# EAGLE design BotMod (EAGLE 9.5.1)
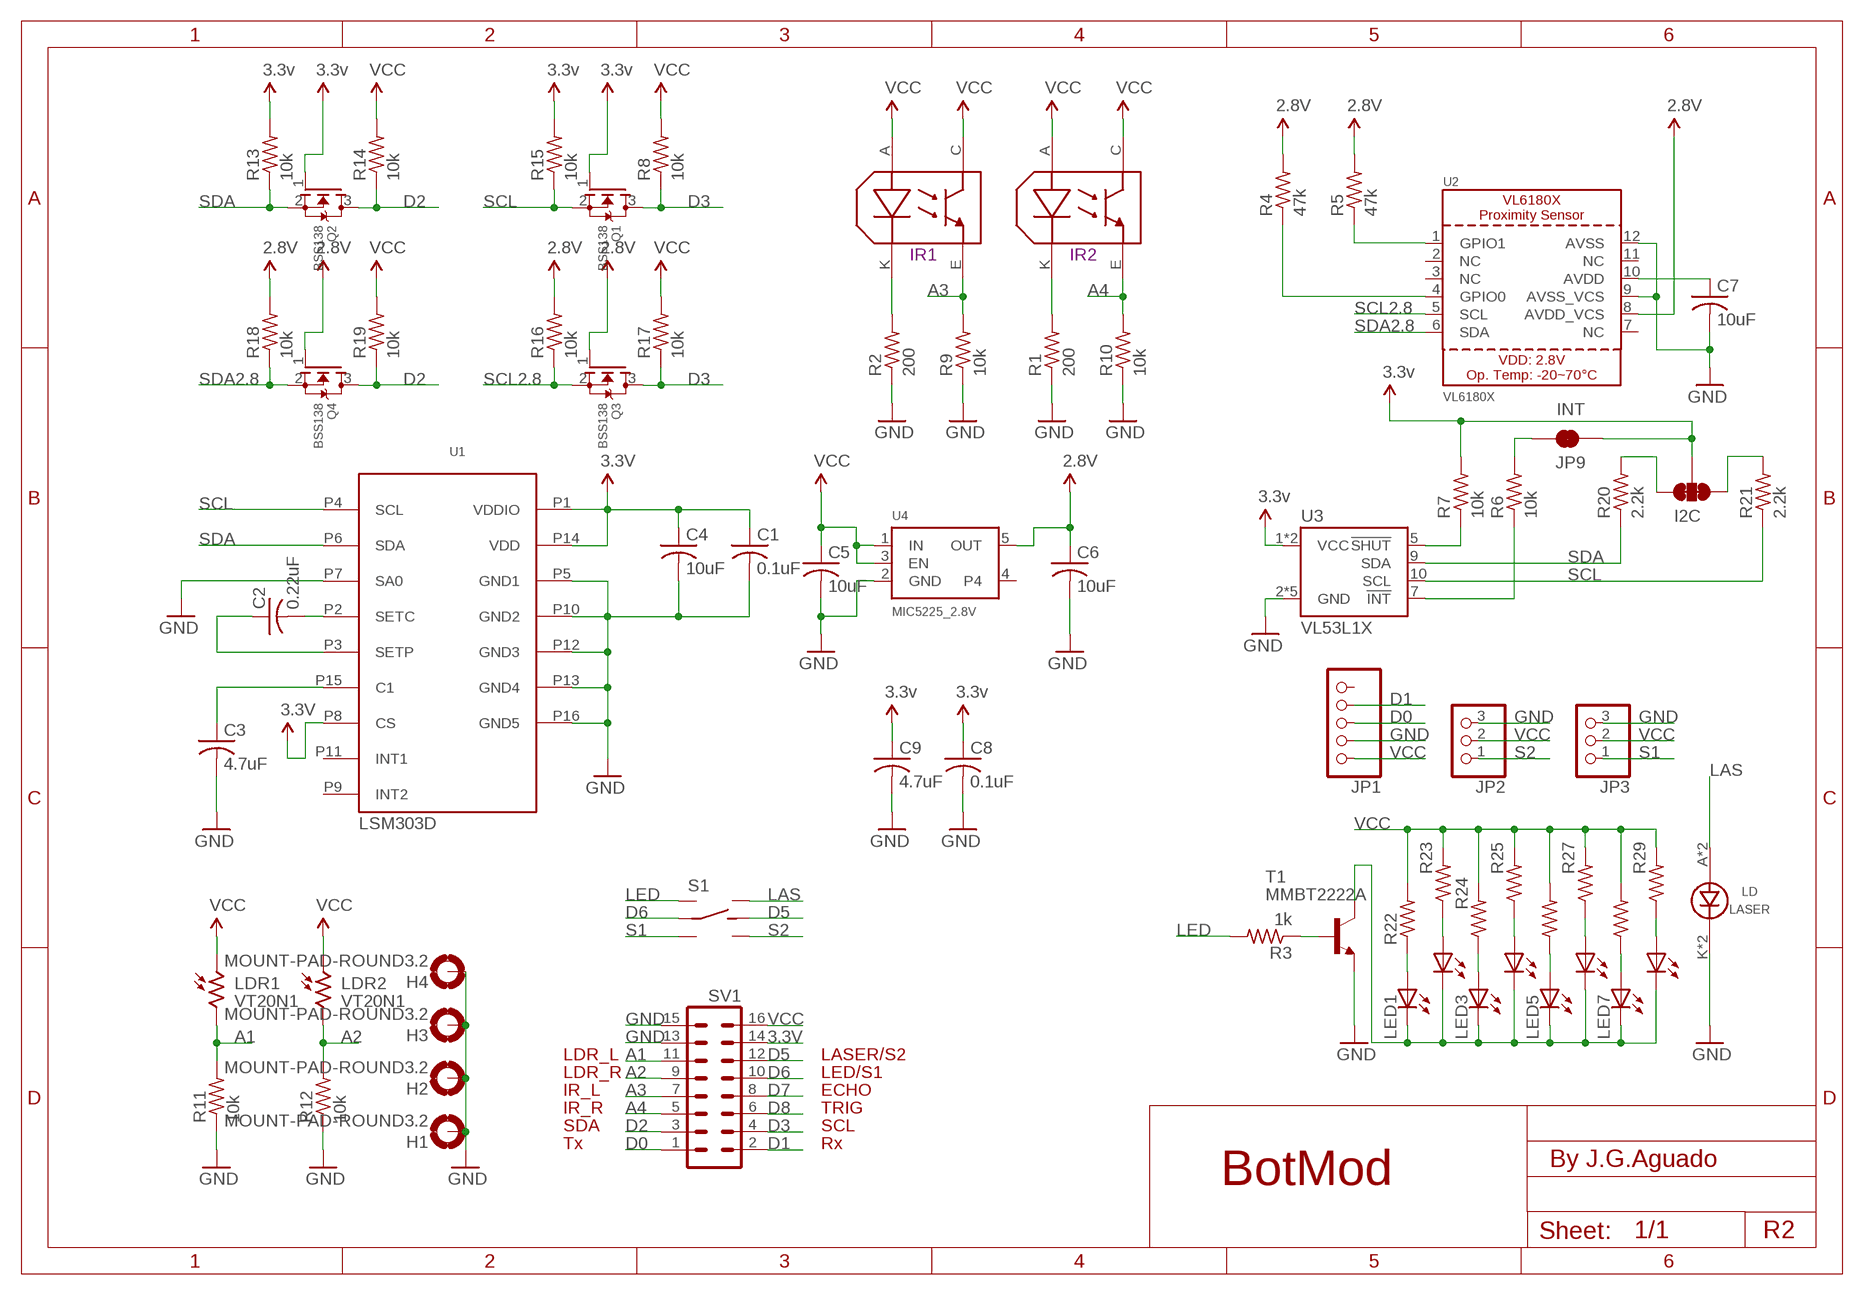
[diagram p0: schematic, sheet 1]

## Parts
C1  0.1uF  C0402  [0402]
C2  0.22uF  C0402  [0402]
C3  4.7uF  C0402  [0402]
C4  10uF  C0402  [0402]
C5  10uF  C0402  [0402]
C6  10uF  C0402  [0402]
C7  10uF  C0402  [0402]
C8  0.1uF  C0402  [0402]
C9  4.7uF  C0402  [0402]
H1  MOUNT-PAD-ROUND3.2  [3,2-PAD]
H2  MOUNT-PAD-ROUND3.2  [3,2-PAD]
H3  MOUNT-PAD-ROUND3.2  [3,2-PAD]
H4  MOUNT-PAD-ROUND3.2  [3,2-PAD]
I2C  JUMPER-SMT_3_2-NC_TRACE_SILK  [SMT-JUMPER_3_2-NC_TRACE_SILK]
IR1  IR_TCRT5000  [IR_TCRT5000]
IR2  IR_TCRT5000  [IR_TCRT5000]
JP1  PINHEAD_5_FEMALE  [PINHEAD_5_FEMALE]
JP2  PINHD-1X3  [1X03]
JP3  PINHD-1X3  [1X03]
JP9  INT  JUMPER-PAD-2-NC_BY_TRACE  [PAD-JUMPER-2-NC_BY_TRACE_YES_SILK]
LD  LASER  KEYES_LASER  [KEYES_LASER]
LDR1  VT20N1  [TO46-VT200]
LDR2  VT20N1  [TO46-VT200]
LED1  LED5730  [LED5730]
LED2  LED5730  [LED5730]
LED3  LED5730  [LED5730]
LED4  LED5730  [LED5730]
LED5  LED5730  [LED5730]
LED6  LED5730  [LED5730]
LED7  LED5730  [LED5730]
LED8  LED5730  [LED5730]
Q1  BSS138  MOSFET-NREFLOW  [SOT23]
Q2  BSS138  MOSFET-NREFLOW  [SOT23]
Q3  BSS138  MOSFET-NREFLOW  [SOT23]
Q4  BSS138  MOSFET-NREFLOW  [SOT23]
R1  200  R0402  [0402]
R2  200  R0402  [0402]
R3  1k  R0402  [0402]
R4  47k  R0402  [0402]
R5  47k  R0402  [0402]
R6  10k  R0402  [0402]
R7  10k  R0402  [0402]
R8  10k  R0402  [0402]
R9  10k  R0402  [0402]
R10  10k  R0402  [0402]
R11  10k  R0402  [0402]
R12  10k  R0402  [0402]
R13  10k  R0402  [0402]
R14  10k  R0402  [0402]
R15  10k  R0402  [0402]
R16  10k  R0402  [0402]
R17  10k  R0402  [0402]
R18  10k  R0402  [0402]
R19  10k  R0402  [0402]
R20  2.2k  R0402  [0402]
R21  2.2k  R0402  [0402]
R22  R1206  [1206]
R23  R1206  [1206]
R24  R1206  [1206]
R25  R1206  [1206]
R26  R1206  [1206]
R27  R1206  [1206]
R28  R1206  [1206]
R29  R1206  [1206]
S1  DPDT_JS202011CQN  [DPDT_JS202011CQN]
SV1  MA08-2  [MA08-2]
T1  MMBT2222A  BC808-NPN-SOT23-BEC  [SOT23-BEC]
U1  LSM303D  [LGA3X3_16L]
U2  VL6180X  [VL6180]
U3  VL53L1X  VL53L1XSMD  [VL53L1X]
U4  MIC5225_2.8V  VREG_SOT23-5  [SOT23-5]

## Nets
2.8V: C6.1 Q3.1(G) Q4.1(G) R4.2 R5.2 R16.2 R18.2 U2.8(AVDD_VCS) U4.5(OUT)
3.3V: C1.1 C4.1 C8.1 C9.1 I2C.2 JP9.1 Q1.1(G) Q2.1(G) R7.2 R13.2 R15.2 SV1.14 U1.P1(VDDIO) U1.P8(CS) U1.P14(VDD) U3.1(VCC) U3.11(VCC) ; supply symbol labelled 3.3v
A1: LDR1.2 R11.2 SV1.11
A2: LDR2.2 R12.2 SV1.9
A3: IR1.E R9.2 SV1.7
A4: IR2.E R10.2 SV1.5
D0: JP1.P$3 SV1.1
D1: JP1.P$4 SV1.2
D2: Q2.3(D) Q4.3(D) R14.1 R19.1 SV1.3
D3: Q1.3(D) Q3.3(D) R8.1 R17.1 SV1.4
D5: S1.5(RC) SV1.12
D6: S1.2(LC) SV1.10
D7: SV1.8
D8: SV1.6
GND: C1.2 C3.2 C4.2 C5.2 C6.2 C7.2 C8.2 C9.2 H1.B3,2(MOUNT) H2.B3,2(MOUNT) H3.B3,2(MOUNT) H4.B3,2(MOUNT) JP1.P$2 JP2.3 JP3.3 LD.K LD.K1(K) R1.1 R2.1 R9.1 R10.1 R11.1 R12.1 SV1.13 SV1.15 T1.E U1.P5(GND1) U1.P7(SA0) U1.P10(GND2) U1.P12(GND3) U1.P13(GND4) U1.P16(GND5) U2.9(AVSS_VCS) U2.12(AVSS) U3.2(GND) U3.3(GND) U3.4(GND) U3.6(GND) U3.12(GND) U4.2(GND)
L1: LED1.P$1(A) R22.1
L2: LED2.P$1(A) R23.1
L3: LED3.P$1(A) R24.1
L4: LED4.P$1(A) R25.1
L5: LED5.P$1(A) R26.1
L6: LED8.P$1(A) R29.1
L7: LED7.P$1(A) R28.1
L8: LED6.P$1(A) R27.1
LAS: LD.A LD.A1(A) S1.4(R1)
LED: R3.2 S1.1(L1)
N$1: LED1.P$2(C) LED2.P$2(C) LED3.P$2(C) LED4.P$2(C) LED5.P$2(C) LED6.P$2(C) LED7.P$2(C) LED8.P$2(C) T1.C
N$2: R3.1 T1.B
N$3: IR1.K R2.2
N$4: IR2.K R1.2
N$5: R5.1 U2.1(GPIO1)
N$6: R4.1 U2.4(GPIO0)
N$7: I2C.3 R20.2
N$8: C7.1 U2.10(AVDD)
N$9: I2C.1 R21.2
N$10: C3.1 U1.P15(C1)
N$11: C2.2 U1.P2(SETC)
N$12: C2.1 U1.P3(SETP)
N$14: JP9.2 R6.2
N$16: R7.1 U3.5(!SHUT)
N$19: R6.1 U3.7(!INT)
S1: JP3.1 S1.3(L2)
S2: JP2.1 S1.6(R2)
SCL: Q1.2(S) R15.1 R21.1 U1.P4(SCL) U3.10(SCL)
SCL2.8: Q3.2(S) R16.1 U2.5(SCL)
SDA: Q2.2(S) R13.1 R20.1 U1.P6(SDA) U3.9(SDA)
SDA2.8: Q4.2(S) R18.1 U2.6(SDA)
VCC: C5.1 IR1.A IR1.C IR2.A IR2.C JP1.P$1 JP2.2 JP3.2 LDR1.1 LDR2.1 R8.2 R14.2 R17.2 R19.2 R22.2 R23.2 R24.2 R25.2 R26.2 R27.2 R28.2 R29.2 SV1.16 U4.1(IN) U4.3(EN)
Unconnected: JP1.P$5 U1.P9(INT2) U1.P11(INT1) U2.2(NC) U2.3(NC) U2.7(NC) U2.11(NC) U4.4

## Notes on the sheet
- IR1 | IR2
- LSM303D
- LDR_L | LASER/S2
- LDR_R | LED/S1
- IR_L | ECHO
- IR_R | TRIG
- SDA | SCL
- Tx | Rx
- By J.G.Aguado
- R2

## Library data of the parts
C1-C9 = Passive_components:C0402
H1-H4 = holes:MOUNT-PAD-ROUND: MOUNTING PAD, round
I2C = SparkFun-Jumpers:JUMPER-SMT_3_2-NC_TRACE: Normally closed trace jumper (2 of 2 connections) This jumper has a trace between all three pads so they are normally closed (NC). Use a razor knife to open the connection(s). For best results follow the IPC guidelines for cutting traces: Cutout at least 0.063 mm (0.005 in). Remove all loose material to clean up the cut area. Seal the cut with an approved epoxy. Reapply solder to reclose the connection(s).
IR1 IR2 = SpaceDIY:IR_TCRT5000
JP1 = SpaceDIY_connectors:PINHEAD_5_FEMALE
JP2 JP3 = pinhead:PINHD-1X3: PIN HEADER
JP9 = SparkFun-Passives:JUMPER-PAD-2-NC_BY_TRACE
LD = SpaceDIY:KEYES_LASER
LDR1 LDR2 = photo-elements:VT2*: Photoconductive Cell VT200 Series Source: http://optoelectronics.perkinelmer.com/content/Datasheets/DTS_vt200seriesdatasheet.pdf
LED1-LED8 = SpaceDIY_passive_components:LED5730
Q1-Q4 = adafruit:MOSFET-N: N-Channel Mosfet 2N7002E - 60V 260mA SOT23 [Digikey: 2N7002ET1GOSTR-ND] - REEL BSH103 - 30V 850mA SOT23 [Digikey: 568-5013-1-ND]
R1-R21 = Passive_components:R0402
R22-R29 = Passive_components:R1206
S1 = bt_electromech:DPDT: Dual Position, Dual Throw (DPDT) Switch
SV1 = con-lstb:MA08-2: PIN HEADER; OC_FARNELL: unknown; OC_NEWARK: unknown
T1 = transistor:*-NPN-: NPN Transistror BF959 corrected 2008.03.06
U1 = LSM303D:LSM303D
U2 = microbuilder:VL6180X: VL6180x Proximity and Light Sensor with Gesture Recognition Supply Level: 2.8V (3.0V Max!) Range: 0-10cm Light Sensor: 0..100K Lux (16-bit output) IR emitter: 850 nm I2C Address: 0x29 (7-bit)
U3 = SparkFun-Sensors:VL53L1X: STMicroelectronics VL53L1X - 400 cm IR Laser ToF Sensor VL53L1X is a state-of-the-art ToF laser-ranging sensor, enhancing the ST FlightSense product family. It is the fastest miniature ToF sensor currently on the market with accurate ranging up to 4 m and fast ranging frequency (up to 50 Hz). Housed in a miniature and reflowable package, it integrates a single photon avalanche diode (SPAD) receiving array, a 940 nm invisible laser Class 1 emitter, physical infrared filters, and optics to achieve the best ranging performance in various ambient lighting conditions with a range of cover window options.; PROD_ID: IC-13960
U4 = microbuilder:VREG_SOT23-5: SOT23-5 Fixed Voltage Regulators Part Current Out V Out V In V Dropout θJA (°C/W) TJ (°C) Digikey Part No. ADP121 150mA 3.3V 3.4-5.5V 0.09V @ 150mA -- -- ADP121-AUJZ33R7CT-ND ADP121 150mA 3.0V 3.1-5.5V 0.09V @ 150mA -- -- ADP121-AUJZ30R7CT-ND ADP122 300mA 3.3V 3.4-5.5V 0.085V @ 300mA -- -- ADP122AUJZ-3.3-R7CT-ND ADP1712 300mA 3.3V 3.5-5.5V 0.17V @ 300mA -- -- ADP1712AUJZ-3.3-R7TR-ND AP7311 (Low Cost) 150mA 3.3V 3.5-6V 0.15V @ 150mA -- -- AP7311-33WG-7DICT-ND LD39015M18R 150mA 1.8V 1.9V-5.5V 0.08V @ 100mA -- -- 497-6977-1-ND LP2985A-33DBVR 150mA 3.3V 3.3-16V 0.28V @ 150mA 206 150 296-18479-1-ND MCP1824T-3302E/OT 300mA 3.3V 3.5V-6V 0.2V @ 300mA -- -- MCP1824T-3302E/OTCT-ND MIC5205-2.5YM5 TR 150mA 2.5V 2.7-16V 0.165V @ 150mA -- -- 576-1257-2-ND MIC5205-3.0YM5 TR 150mA 3.0V 3.2V-16V 0.165V @ 150mA -- -- 576-1258-2-ND MIC5205-3.3YM5 TR 150mA 3.3V 3.5V-16V 0.165V @ 150mA -- -- 576-1259-2-ND TPS780330220 150mA 3.3V+2.2V 3.6-5.5V 250mV Max -- -- 296-23332-1-ND TDA3663/N1,135 100mA 3.3V 3.5-45V 0.18V @ 50mA -- -- 568-5343-1-ND Max operating temp can be calculated using θJA, TJ (max junction temperature), and power in watts. Set the "Maximum Ambient Temperature" until it reaches TJ ("Max Junction Temperature"), which is the absolute limit for safe use of the regulator: Heat Sink Temperature Calculator <http://www.daycounter.com/Calculators/Heat-Sink-Temperature-Calculator.phtml> For example, With 12V source into a 3.3V LP2985 and a 30mA load, we are dissipating (12V-3.3V) * 0.03A = 0.261W. With a θJA of 206 °C/W, a TJ of 150°C, and 261mW we can safely use the chip without a heat sink up to 75°C (=147.1°C Junction Temperature).

## Net classes
1 vcc: width 0.254 mm

## Board
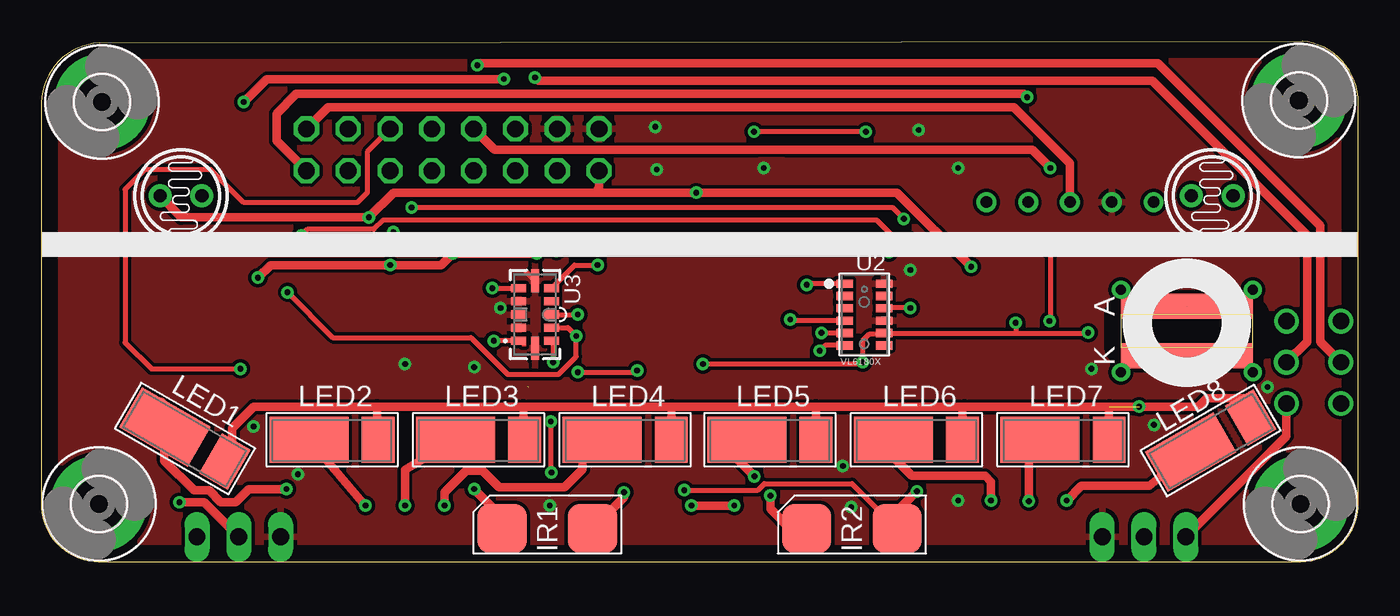
[diagram p1: board, top side]
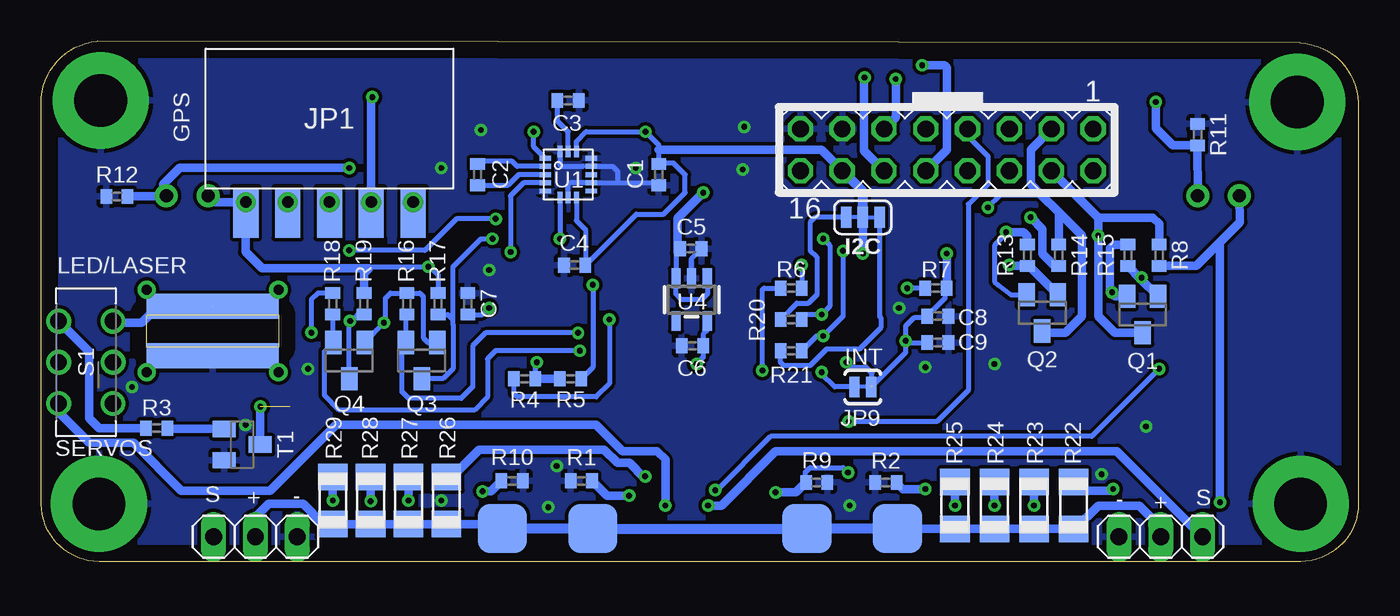
[diagram p2: board, bottom side, seen from below]

Size 80.02 x 31.6 mm. Coordinates in mm from the lower left corner, seen from the top.
Outline: 0,27.53 0,3.5 arc90 3.5,0 76.5,0 arc90 80,3.5 80,27.5 arc90 76.61,31.6 3.55,31.5 arc90 0,27.53
Copper layers (1*16): Top 0.035mm / dielectric 1.5mm / Bottom 0.035mm
Design rules "PCBWay": minimum track width 6mil, minimum drill 0.3mm, track to track 0.205mm, track to pad 0.205mm, pad to pad 0.205mm, via to via 0.205mm, smd to smd 8mil, copper to edge 40mil, drill to drill 8mil, minimum pad ring 10mil, minimum via ring 8mil, stop-mask expansion 4mil, vias tented up to drill 25mil, thermal gap 10mil

### Footprints (pad centres in the part's own frame; a part is rotated, then mirrored left to right if it is on the bottom)
0402 = smd 0.7 x 0.9: 1 -0.65,0; 2 0.65,0
3,2-PAD = drill 3.2 pad 5.842: B3,2 0,0
SMT-JUMPER_3_2-NC_TRACE_SILK = smd 0.635 x 1.27: 1 -1.016,0; 2 0,0; 3 1.016,0
IR_TCRT5000 = smd 3 x 3 bottom: A -2.75,0; C 2.75,0 | smd 3 x 3: E 2.75,0; K -2.75,0
PINHEAD_5_FEMALE = drill 0.7: P$1 -5.08,-5.08; P$2 -2.54,-5.08; P$3 0,-5.08; P$4 2.54,-5.08; P$5 5.08,-5.08 | smd 1.524 x 3.048: P$6 -5.08,-5.715; P$7 -2.54,-5.715; P$8 0,-5.715; P$9 2.54,-5.715; P$10 5.08,-5.715
1X03 = drill 1.016 long: 1 -2.54,0; 2 0,0; 3 2.54,0
PAD-JUMPER-2-NC_BY_TRACE_YES_SILK = smd 0.635 x 1.27: 1 -0.508,0; 2 0.508,0
KEYES_LASER = smd 1.5 x 8 bottom: A 1.5,0; K -1.5,0 | smd 1.5 x 8: A1 1.5,0; K1 -1.5,0 | drill 0.6: P$1 -2.5,4; P$2 -2.5,-4; P$3 2.5,-4; P$4 2.5,4
TO46-VT200 = drill 0.8 pad 1.4: 1 -1.27,0; 2 1.27,0
LED5730 = smd 4.8 x 2.8: P$1 -1.525,-0.11 | smd 2 x 2.8: P$2 2.675,-0.11
SOT23 = smd 1 x 1.4: 1 -0.95,-1.1; 2 0.95,-1.1; 3 0,1.1
1206 = smd 1.6 x 1.803: 1 -1.422,0; 2 1.422,0
DPDT_JS202011CQN = drill 1: 1 -2.5,-1.65; 2 0,-1.651; 3 2.5,-1.65; 4 -2.5,1.65; 5 0,1.651; 6 2.5,1.65
MA08-2 = drill 1.016 octagon: 1 -8.89,-1.27; 2 -8.89,1.27; 3 -6.35,-1.27; 4 -6.35,1.27; 5 -3.81,-1.27; 6 -3.81,1.27; 7 -1.27,-1.27; 8 -1.27,1.27; 9 1.27,-1.27; 10 1.27,1.27; 11 3.81,-1.27; 12 3.81,1.27; 13 6.35,-1.27; 14 6.35,1.27; 15 8.89,-1.27; 16 8.89,1.27
SOT23-BEC = smd 1 x 1.4: B -0.95,-1.1; C 0,1.1; E 0.95,-1.1
LGA3X3_16L = smd 0.7 x 0.3: P1 -1.4,1; P2 -1.4,0.5; P3 -1.4,0; P4 -1.4,-0.5; P5 -1.4,-1; P9 1.4,-1; P10 1.4,-0.5; P11 1.4,0; P12 1.4,0.5; P13 1.4,1 | smd 0.3 x 0.7: P6 -0.5,-1.4; P7 0,-1.4; P8 0.5,-1.4; P14 0.5,1.4; P15 0,1.4; P16 -0.5,1.4
VL6180 = smd 1 x 0.5: 1 -1.2,1.875; 2 -1.2,1.125; 3 -1.2,0.375; 4 -1.2,-0.375; 5 -1.2,-1.125; 6 -1.2,-1.875; 7 1.2,-1.875; 8 1.2,-1.125; 9 1.2,-0.375; 10 1.2,0.375; 11 1.2,1.125; 12 1.2,1.875
VL53L1X = smd 0.5 x 0.9: 1 1.6,-1; 2 0.8,-1; 3 0,-1; 4 -0.8,-1; 5 -1.6,-1; 7 -1.6,1; 8 -0.8,1; 9 0,1; 10 0.8,1; 11 1.6,1 | smd 1.4 x 0.5: 6 -2.05,0; 12 2.05,0
SOT23-5 = smd 0.55 x 1.2: 1 -0.95,-1.3; 2 0,-1.3; 3 0.95,-1.3; 4 0.95,1.3; 5 -0.95,1.3

### Placement (x,y rotation side)
C1  42.5,23.5 270 bottom
C2  53.5,23.5 90 bottom
C3  48,28 0 bottom
C4  47.6,18 180 bottom
C5  40.55,19 0 bottom
C6  40.45,13.1 180 bottom
C7  54.1,15.65 90 bottom
C8  25.55,14.9 0 bottom
C9  25.55,13.3 0 bottom
H1  3.7,27.9 0 top
H2  76.4,28 0 top
H3  76.5,3.5 0 top
H4  3.5,3.5 0 top
I2C  30.1,20.9 180 bottom
IR1  30.75,2 0 top
IR2  49.25,2 0 top
JP1  62.5,26.9 0 bottom
JP2  67,1.5 0 bottom
JP3  12,1.5 180 bottom
JP9  30.1,10.6 180 bottom
LD  69.6,14 90 top
LDR1  8.49,22.21 0 top
LDR2  71.14,22.21 0 top
LED1  8.9,7.5 330 top
LED2  17.8,7.5 0 top
LED3  26.7,7.5 0 top
LED4  35.6,7.5 0 top
LED5  44.4,7.5 0 top
LED6  53.3,7.5 0 top
LED7  62.2,7.5 0 top
LED8  71.1,7.5 30 top
Q1  13.1,15 180 bottom
Q2  19.2,15.1 180 bottom
Q3  56.9,12.2 180 bottom
Q4  61.3,12.2 180 bottom
R1  47.2,4.9 0 bottom
R2  28.7,4.8 0 bottom
R3  73,8.1 180 bottom
R4  50.65,11.1 0 bottom
R5  47.85,11.1 180 bottom
R6  34.45,16.6 180 bottom
R7  25.65,16.6 0 bottom
R8  12.1,18.6 270 bottom
R9  32.9,4.8 180 bottom
R10  51.4,4.9 180 bottom
R11  9.76,25.92 270 bottom
R12  75.41,22.17 0 bottom
R13  20.1,18.6 270 bottom
R14  18.2,18.6 270 bottom
R15  14,18.6 270 bottom
R16  57.8,15.65 90 bottom
R17  55.9,15.65 90 bottom
R18  62.3,15.65 90 bottom
R19  60.4,15.65 90 bottom
R20  34.45,14.7 180 bottom
R21  34.45,12.8 180 bottom
R22  17.3,3.4 270 bottom
R23  19.7,3.4 270 bottom
R24  22.1,3.4 270 bottom
R25  24.5,3.4 270 bottom
R26  55.4,3.7 270 bottom
R27  57.7,3.7 270 bottom
R28  60,3.7 270 bottom
R29  62.3,3.7 270 bottom
S1  77.3,12.1 270 bottom
SV1  25,25 180 bottom
T1  67.8,7.1 270 bottom
U1  48,23.5 0 bottom
U2  50,15 0 top
U3  30,15 270 top
U4  40.5,15.9 180 bottom

### Tracks (layer width: path | path; a pad name or v marks a point on that pad's centre or on a via)
2.8V  (via drill 0.35)
  Top 0.305: v40.2,12 49.8,12 v49.9,12.1 49.9,13.4 50.3,13.8 51.13,13.8 U2.8 59.2,13.88 | v63.6,13.9 63.58,13.88 59.2,13.88 | v59.2,14.5 59.2,13.88
  Bottom 0.305: U4.5 39.55,14.05 39.8,13.8 C6.1 39.8,12.4 v40.2,12 | v49.9,12.1 50,12 R4.2 | Q3.1 56.5,13.3 56.8,13.6 56.8,16.1 57,16.3 R16.2 58.8,16.3 59.1,16 59.1,14.6 v59.2,14.5 60.35,13.35 Q4.1 | R18.2 63.2,16.3 63.6,15.9 v63.6,13.9
  Bottom 0.508: R5.2 R4.2
3.3V  (via drill 0.35)  (1 unrouted)
  Top 0.305: v50.1,26.1 v43.3,26.1 | U3.1 v27.5,13.4 | U3.11 31.1,13.3 v31.1,12.1
  Top 0.508: v30.1,18.7 v25,18.7 24.3,18 v21.2,18 13.93,18 v13.17,17.24
  Bottom 0.305: U1.P14 47.5,25.5 46.9,26.1 v43.3,26.1 42.5,25.3 42.5,25 C1.1 42.45,24.2 41.6,24.2 40.9,23.5 40.9,22.4 42.2,21.1 43.85,21.1 C4.1 46.95,20.15 47.5,20.7 U1.P8 | U1.P1 50.1,25.2 v50.1,26.1 | v27.5,13.4 27.4,13.3 C9.1 | v27.5,13.4 27.5,14.3 27,14.8 26.3,14.8 C8.1 25.61,15.49 25.61,15.5 25.4,15.71 25.1,16 25.1,16.5 R7.2 | v31.1,12.1 30.8,11.8 29.9,11.8 29.54,11.44 29.54,10.66 27.5,12.69 v27.5,13.4
  Bottom 0.508: Q1.1 13.23,17.18 | 13.23,17.18 R15.2 | Q2.1 20,17.95 R13.2 21.15,17.95 v21.2,18 | I2C.2 v30.1,18.7 | v25,18.7 R7.2 | v13.17,17.24 13.23,17.18 | SV1.14 32.62,25 42.5,25
  Bottom 0.61: I2C.2 30.1,22.48 SV1.14
A1  (via drill 0.35)
  Top 0.508: v12.3,27.9 13.7,29.3 v28.1,29.3
  Bottom 0.508: LDR1.2 9.79,25.24 R11.2 11.27,25.27 12.3,26.3 v12.3,27.9 | v28.1,29.3 28.1,26.98 SV1.11
A2  (via drill 0.35)
  Top 0.508: SV1.9 27.54,25 43.48,25 45.3,25 60.2,25 v61.3,23.9
  Bottom 0.508: R12.2 72.48,22.17 | 72.48,22.17 LDR2.2 | v61.3,23.9 71.6,23.9 72.6,22.9 72.6,22.29 72.48,22.17
A3  (via drill 0.35)
  Top 0.305: v31,5.4 30.96,5.44 v30.96,8.5
  Top 0.508: v35.4,4.2 35.4,3.9 IR1.E
  Bottom 0.305: SV1.7 23.73,25.83 22.5,24.6 22.5,22.9 23.7,21.7 23.7,10.4 25.6,8.5 v30.96,8.5 | R9.2 33.6,4.85 33.6,5.4 33.3,5.7 31.3,5.7 v31,5.4
  Bottom 0.508: R9.2 34.15,4.2 v35.4,4.2
A4  (via drill 0.35)
  Top 0.305: SV1.5 19.8,24.88 19.8,22.4 19.2,21.8 12.3,21.8 10.3,23.8 6.3,23.8 5.1,22.6 5.1,13.3 6.7,11.7 v12.1,11.7 | v39.07,4.33 43.53,4.33 43.94,4.74 49.27,4.74 IR2.E
  Top 0.508: v53.2,4.26 52,3.06 IR2.E
  Bottom 0.305: v12.1,11.7 16.2,7.6 35.7,7.6 38.97,4.33 v39.07,4.33
  Bottom 0.508: R10.2 52.69,4.26 v53.2,4.26
D0
  Top 0.508: SV1.1 17.44,27.6 59.1,27.6 62.5,24.2 JP1.P$3
D1  (via drill 0.35)
  Top 0.508: SV1.2 14.3,25.54 14.3,27.2 15.5,28.4 59.7,28.4 v59.9,28.2
  Bottom 0.508: JP1.P$4 59.96,28.14 v59.9,28.2
D2  (via drill 0.35)
  Top 0.305: v22.5,21.5 51.72,21.5 v52.41,20.81 | v61.3,18.9 61.3,14.66 v61.25,14.61
  Bottom 0.305: Q4.3 61.3,14.5 | R19.1 60.8,15 61.3,14.5 | 19.25,22.25 21.75,22.25 v22.5,21.5 | v52.41,20.81 54.8,20.81 56.7,18.9 v61.3,18.9 | v61.25,14.61 61.3,14.56 61.3,14.5
  Bottom 0.508: SV1.3 19.9,25.02 19.9,22.9 19.25,22.25 18.2,21.2 | 18.2,21.2 16.8,19.8 16.8,14.9 17.8,13.9 19.1,13.9 Q2.3 | R14.1 18.2,21.2
D3  (via drill 0.35)
  Top 0.305: v52.6,19.6 51.9,19.6 50.77,20.74 20.78,20.74 20.21,20.16 16.17,20.16 v15.8,19.8
  Bottom 0.305: R17.1 55.3,15 55.01,14.71 | 55.01,14.71 55.01,14.4 55,14.39 55,11.7 55.6,11.1 Q3.3 | 55.01,14.71 55,14.71 55,17.9 53.3,19.6 v52.6,19.6
  Bottom 0.508: Q1.3 14.8,13.9 15.8,14.9 v15.8,19.8 15.8,20.88 | SV1.4 15.8,20.88 | R8.1 12.1,20.5 12.48,20.88 15.8,20.88
D5  (via drill 0.35)
  Top 0.508: S1.5 76.9,13.35 76.9,19.8 67.5,29.2 30.2,29.2 v30,29.4
  Bottom 0.508: v30,29.4 30.03,29.37 30.03,24.95 SV1.12
D6  (via drill 0.35)
  Top 0.508: S1.2 77.7,13.35 77.7,20.4 67.84,30.27 26.63,30.27 v26.5,30.14
  Bottom 0.508: SV1.10 25,25 25,30 25.14,30.14 v26.5,30.14
GND  (via drill 0.35)
  Top 0.305: U3.6 29.45,17.6
  Bottom 0.305: 45,23 U1.P10 47.9,23 48,22.9 U1.P7 | 45,23 42.65,23 C1.2 | U1.P12 45.3,24 45,23.7 45,23 | U1.P16 48.5,24.1 48.4,24 47.11,24 47.1,24.01 | C5.2 40.5,18.41 40.5,18.4 40.5,18.39 U4.2
  other vias: 37.3,26.4 37.4,23.8 53.3,26.2 55.7,23.9 52.8,17.7 74.5,10.6 63.8,11.7 27.9,15.4 26.3,11.8 22.1,12 43.9,23.9 30.9,3.4 15.6,5.3 12.9,8.2 49.2,3.3 48.7,5.8 55.7,3.7 67.6,8.3
  pour Top: 3.6,31.5 76.6,31.5 arc-90 80,28.1 80,3.5 arc-90 76.5,0 3.5,0 arc-90 0,3.5 0,27.9 arc-90
  pour Bottom: 76,31.5 arc-90 80,27.5 80,3.5 arc-90 76.5,0 3.5,0 arc-90 0,3.5 0,28 arc-90 3.5,31.5
L1  (via drill 0.35)
  Top 0.508: LED1.P$1 7.49,8.47 | 7.49,8.47 7.33,9.7 | v14.9,4.4 12.6,4.4 11.8,3.6 10.91,3.6 10.2,4.31 9.29,4.31 7.49,6.12 7.49,8.47
  Bottom 0.508: R22.1 16.78,4.3 15,4.3 v14.9,4.4
L2  (via drill 0.35)
  Top 0.508: v19.7,3.4 19.55,3.55 LED2.P$1
  Bottom 0.508: R23.1 v19.7,3.4
L3  (via drill 0.35)
  Top 0.508: v22.1,3.4 22.1,5.58 LED3.P$1
  Bottom 0.508: R24.1 v22.1,3.4
L4  (via drill 0.35)
  Top 0.508: v24.5,3.4 24.5,4.2 25.8,5.5 26.8,5.5 27.8,4.5 31.8,4.5 32.9,5.6 32.9,7.29 LED4.P$1
  Bottom 0.508: R25.1 v24.5,3.4
L5  (via drill 0.35)
  Top 0.508: v43.33,5.17 41.61,6.89 LED5.P$1
  Bottom 0.508: R26.1 55.08,5.12 53.4,6.8 45.81,6.8 45,5.99 44.29,5.99 43.4,5.1 v43.33,5.17
L6  (via drill 0.35)
  Top 0.508: LED8.P$1 67.33,4.6 63.2,4.6 v62.3,3.7
  Bottom 0.508: R29.1 v62.3,3.7
L7  (via drill 0.35)
  Top 0.508: v60,3.66 60,6.79 LED7.P$1
  Bottom 0.508: R28.1 v60,3.66
L8  (via drill 0.35)
  Top 0.508: v57.7,3.7 57.7,4.85 57.35,5.2 52.9,5.2 50.71,7.39 LED6.P$1
  Bottom 0.508: v57.7,3.7 R27.1
LAS  (1 unrouted)
  Bottom 0.508: LD.A1 72.9,15.5 73.9,14.5 75.55,14.5 S1.4
LED
  Bottom 0.508: S1.1 77.1,12.75 77.1,8.7 76.5,8.1 R3.2
N$1  (via drill 0.35)  (1 unrouted)
  Top 0.508: LED1.P$2 11.6,6.51 11.6,8.1 12.9,9.4 20.4,9.4 | 20.4,9.4 20.4,7.4 LED2.P$2 | 20.4,9.4 29.3,9.4 | 29.3,9.4 29.3,7.4 LED3.P$2 | 29.3,9.4 38.3,9.4 | 38.3,9.4 38.3,7.42 LED4.P$2 | 38.3,9.4 47.07,9.4 | LED5.P$2 47.08,9.39 47.07,9.4 | 56.1,9.4 55.98,9.28 LED6.P$2 | LED8.P$2 73.48,9.44 73.02,9.9 70.8,9.9 70.3,9.4 64.9,9.4 | 47.07,9.4 56.1,9.4 | 56.1,9.4 64.9,9.4 | LED7.P$2 64.88,9.38 64.9,9.4
  Bottom 0.508: 66.8,7 T1.C v66.7,9.4
N$2
  Bottom 0.508: R3.1 72.3,8.05 T1.B
N$3  (via drill 0.35)
  Top 0.508: v26.3,4.4 28,2.7 IR1.K
  Bottom 0.508: R2.2 27.65,4.4 v26.3,4.4
N$4  (via drill 0.35)
  Top 0.508: v44.3,4 44.3,3.2 45.5,2 IR2.K
  Bottom 0.508: R1.2 45.65,4 v44.3,4
N$5  (via drill 0.35)
  Top 0.305: U2.1 46.58,16.88 v46.5,16.8
  Bottom 0.305: v46.5,16.8 46.5,11.8 R5.1
N$6  (via drill 0.35)
  Top 0.305: U2.4 45.58,14.62 v45.5,14.7
  Bottom 0.305: v45.5,14.7 45.5,10.8 46.3,10 51.1,10 51.3,10.2 R4.1
N$7
  Bottom 0.305: R20.2 34.51,15.29 34.51,15.3 34.12,15.69 33.41,15.69 32.9,16.2 32.9,18.5 33.3,18.9 33.3,20.6 33,20.9 I2C.3
N$8  (via drill 0.35)
  Top 0.305: v52.8,15.4 51.23,15.4 U2.10
  Bottom 0.305: C7.1 53.2,15 v52.8,15.4
N$9
  Bottom 0.305: I2C.1 29.09,14.88 29,14.8 29,14.2 30.3,12.9 32.3,12.9 33.3,11.9 34.9,11.9 35.1,12.1 R21.2
N$10
  Bottom 0.305: U1.P15 48,26.1 48.65,26.75 C3.1
N$11
  Bottom 0.305: U1.P2 51.1,24 51.4,24.3 53.35,24.3 C2.2
N$12
  Bottom 0.305: C2.1 51.65,22.85 51,23.5 U1.P3
N$14  (via drill 0.35)
  Top 0.305: v32.6,11.5 36.1,11.5 v36.2,11.6
  Bottom 0.305: JP9.2 31.81,10.6 32.66,11.45 v32.6,11.5 | v36.2,11.6 36.2,16.5 36.1,16.6 R6.2
N$16  (via drill 0.35)
  Top 0.305: v27.4,16.6 U3.5
  Bottom 0.305: R7.1 v27.4,16.6
N$19  (via drill 0.35)
  Top 0.305: U3.7 32.4,18 v33.8,18
  Bottom 0.305: v33.8,18 R6.1
S1  (via drill 0.35)
  Top 0.508: v42.1,3.4 v39.5,3.4
  Bottom 0.508: v42.1,3.4 42.1,6.2 42.6,6.7 44.7,6.7 46.3,8.3 62.1,8.3 66.1,4.3 71.5,4.3 74.4,7.2 77.1,7.2 78.95,9.05 S1.3 | v39.5,3.4 38.7,3.4 35.4,6.7 14.66,6.7 JP3.1
S2
  Top 0.508: JP2.1 75.65,7.61 S1.6
SCL  (via drill 0.35)
  Top 0.305: U3.10 32,14.2 v32.5,13.7 32.5,12.44 31.43,11.36 28.34,11.36 26.1,13.6 17.72,13.6 v14.97,16.35 | v51.5,18.8 31.37,18.8 v31.3,18.86
  Bottom 0.305: R21.1 32.9,13.7 v32.5,13.7 31.3,14.9 v31.3,18.86 | U1.P4 50.7,23 51.5,22.2 v51.5,18.8 | 15.09,16.39 15.05,16.35 v14.97,16.35
  Bottom 0.508: R15.1 14.85,19.25 15.09,19.01 15.09,16.39 14.8,16.1 Q1.2
SCL2.8  (via drill 0.35)
  Top 0.305: U2.5 47.42,13.88 v47.4,13.89
  Bottom 0.305: R16.1 57.85,14.95 Q3.2 58.1,13.05 58.1,10.3 57.7,9.9 54.5,9.9 53.8,10.6 53.8,13.1 53.01,13.89 v47.4,13.89
SDA  (via drill 0.35)
  Top 0.305: v48.5,19.6 v32.5,19.6 32.3,19.8 21.6,19.8 v21.4,20 | U3.9 v32.6,15
  Bottom 0.305: U1.P6 v48.5,19.6 | v21.4,20 21.4,19.9 22.1,19.2 22.1,17 21.9,16.8 21.1,16.2 Q2.2 | R20.1 33.5,15 v32.6,15 32.1,15.5 32.1,19.2 v32.5,19.6
  Bottom 0.508: R13.1 20.1,19.75 20.35,20 v21.4,20
SDA2.8  (via drill 0.35)
  Top 0.305: U2.6 47.63,13.12 v47.3,12.8
  Bottom 0.305: v47.3,12.8 52.4,12.8 52.9,12.3 52.9,10 53.7,9.2 61.9,9.2 62.8,10.1 62.8,12.75 Q4.2 62.3,13.35 R18.1
VCC  (via drill 0.35)
  Top 0.508: SV1.16 33.89,22.69 33.6,22.4 | 33.6,22.4 21.4,22.4 v19.9,20.9 8.5,20.9 LDR1.1 | 33.6,22.4 v39.8,22.4 52,22.4 v56.5,17.9 | JP3.2 9.9,3.6 v8.4,3.6
  Bottom 0.305: C5.1 41.35,18.85 41.45,18.75 U4.3 41.45,16.25 41.1,15.9 39.9,15.9 39.55,16.25 U4.1 | 60.1,17.8 60,17.9 v56.5,17.9 56.4,17.9 55.9,17.4 R17.2
  Bottom 0.508: R8.2 9.85,17.95 8.4,19.4 | LDR1.1 7.19,20.61 8.4,19.4 | R14.2 18.45,17.95 19.2,18.7 19.19,18.71 19.19,20.19 v19.9,20.9 | JP3.2 12,2.1 13.3,3.4 15.8,3.4 17.23,1.98 R22.2 R23.2 R24.2 R25.2 27.98,1.98 IR1.A | R19.2 60.4,17.5 60.1,17.8 66.6,17.8 67.6,18.8 67.6,21.8 JP1.P$1 69.45,21.82 LDR2.1 | v39.8,22.4 41.35,20.85 41.35,18.85 | 8.4,19.4 v8.4,3.6 | IR2.C 52.28,2.28 R26.2 R27.2 R28.2 R29.2 62.88,2.28 64.1,3.5 66.2,3.5 67.1,2.6 67.1,1.6 JP2.2
  Bottom 0.61: IR1.A IR1.C IR2.A IR2.C

### Text on the board
bPlace: U1
bNames: GPS | LED/LASER | SERVOS | S | + | - | - | + | S